# EAGLE schematic connecting (EAGLE 7.5.0)
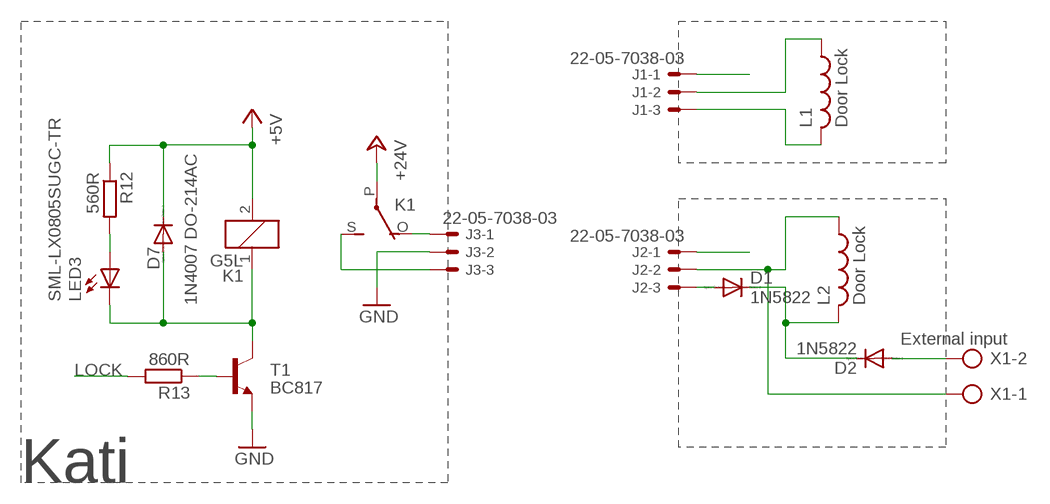
[diagram p0: schematic, sheet 1]

## Parts
D1  1N5822  1N5059  [DO204-10]
D2  1N5822  1N5059  [DO204-10]
D7  1N4007 DO-214AC  DIODE-DO-214AC  [DO-214AC]
J1  22-05-7038-03  [7395-03]
J2  22-05-7038-03  [7395-03]
J3  22-05-7038-03  [7395-03]
K1  G5L  [G5LE]
L1  Door Lock  L-US0204/5  [0204/5]
L2  Door Lock  L-US0204/5  [0204/5]
LED3  SML-LX0805SUGC-TR  LEDCHIPLED_0805  [CHIPLED_0805]
R12  560R  R-EU_R0805  [R0805]
R13  860R  R-EU_R0805  [R0805]
T1  BC817  BC817-16-NPN-SOT23-BEC  [SOT23-BEC]
X1  External input  AK300/2  [AK300/2]

## Nets
+5V: D7.C K1.2 R12.1
+24V: K1.P(2:P)
GND: J3.2 T1.E
LOCK: R13.2
N$1: J1.2 L1.1
N$2: J1.3 L1.2
N$3: J1.1
N$4: J2.2 L2.1 X1.1
N$5: J3.3 K1.S(2:S)
N$6: D1.C D2.C L2.2
N$7: J3.1 K1.O(2:O)
N$8: D7.A K1.1 LED3.C T1.C
N$9: J2.1
N$10: R13.1 T1.B
N$11: LED3.A R12.2
N$12: D1.A J2.3
N$13: D2.A X1.2

## Notes on the sheet
- Kati

## Library data of the parts
D1 D2 = diode:1N5059: DIODE controlled avalanche rectifier
D7 = diode:DIODE-: DIODE
J1-J3 = con-molex:22-?-03: CONNECTOR wire to board 2.54 mm (.1 inch) pitch header; OC_FARNELL: unknown; OC_NEWARK: unknown
K1 = relay:G5L: RELAY 1 x switch, 10 A/120 V AC, 8 A/30 V ADC, Omron; OC_FARNELL: unknown; OC_NEWARK: unknown
L1 L2 = rcl:L-US: INDUCTOR, American symbol
LED3 = led:LED: LED OSRAM: - CHIPLED LG R971, LG N971, LY N971, LG Q971, LY Q971, LO R971, LY R971 LH N974, LH R974 LS Q976, LO Q976, LY Q976 LO Q996 - Hyper CHIPLED LW Q18S LB Q993, LB Q99A, LB R99A - SideLED LS A670, LO A670, LY A670, LG A670, LP A670 LB A673, LV A673, LT A673, LW A673 LH A674 LY A675 LS A676, LA A676, LO A676, LY A676, LW A676 LS A679, LY A679, LG A679 - Hyper Micro SIDELED® LS Y876, LA Y876, LO Y876, LY Y876 LT Y87S - SmartLED LW L88C, LW L88S LB L89C, LB L89S, LG L890 LS L89K, LO L89K, LY L89K LS L896, LA L896, LO L896, LY L896 - TOPLED LS T670, LO T670, LY T670, LG T670, LP T670 LSG T670, LSP T670, LSY T670, LOP T670, LYG T670 LG T671, LOG T671, LSG T671 LB T673, LV T673, LT T673, LW T673 LH T674 LS T676, LA T676, LO T676, LY T676, LB T676, LH T676, LSB T676, LW T676 LB T67C, LV T67C, LT T67C, LS T67K, LO T67K, LY T67K, LW E67C LS E67B, LA E67B, LO E67B, LY E67B, LB E67C, LV E67C, LT E67C LW T67C LS T679, LY T679, LG T679 LS T770, LO T770, LY T770, LG T770, LP T770 LB T773, LV T773, LT T773, LW T773 LH T774 LS E675, LA E675, LY E675, LS T675 LS T776, LA T776, LO T776, LY T776, LB T776 LHGB T686 LT T68C, LB T68C - Hyper Mini TOPLED® LB M676 - Mini TOPLED Santana® LG M470 LS M47K, LO M47K, LY M47K Source: http://www.osram.convergy.de LUXEON: - LUMILED® LXK2-PW12-R00, LXK2-PW12-S00, LXK2-PW14-U00, LXK2-PW14-V00 LXK2-PM12-R00, LXK2-PM12-S00, LXK2-PM14-U00 LXK2-PE12-Q00, LXK2-PE12-R00, LXK2-PE12-S00, LXK2-PE14-T00, LXK2-PE14-U00 LXK2-PB12-K00, LXK2-PB12-L00, LXK2-PB12-M00, LXK2-PB14-N00, LXK2-PB14-P00, LXK2-PB14-Q00 LXK2-PR12-L00, LXK2-PR12-M00, LXK2-PR14-Q00, LXK2-PR14-R00 LXK2-PD12-Q00, LXK2-PD12-R00, LXK2-PD12-S00 LXK2-PH12-R00, LXK2-PH12-S00 LXK2-PL12-P00, LXK2-PL12-Q00, LXK2-PL12-R00 Source: www.luxeon.com KINGBRIGHT: KA-3528ASYC Source: www.kingbright.com
R12 R13 = rcl:R-EU_: RESISTOR, European symbol
T1 = transistor:*-NPN-: NPN Transistror BF959 corrected 2008.03.06
X1 = con-ptr500:AK300/2: CONNECTOR; OC_FARNELL: unknown; OC_NEWARK: unknown